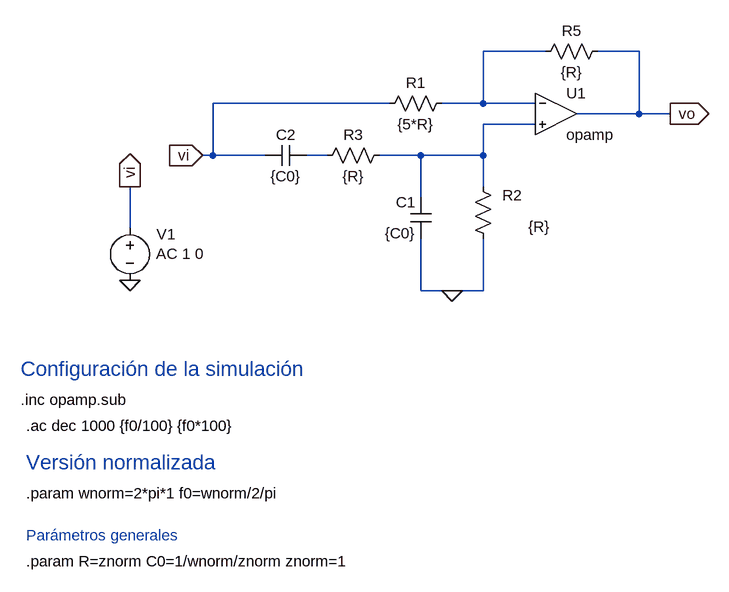
[diagram p0: schematic TS1.asc]
TS1.asc, the LTspice schematic file:
Version 4.1
SHEET 1 2616 1448
WIRE 256 -64 160 -64
WIRE 400 -64 336 -64
WIRE 16 16 -256 16
WIRE 160 16 160 -64
WIRE 160 16 96 16
WIRE 240 16 160 16
WIRE 400 32 400 -64
WIRE 400 32 304 32
WIRE 448 32 400 32
WIRE 240 48 160 48
WIRE -256 96 -256 16
WIRE -256 96 -272 96
WIRE -176 96 -256 96
WIRE -80 96 -112 96
WIRE 64 96 0 96
WIRE 160 96 160 48
WIRE 160 96 64 96
WIRE 160 144 160 96
WIRE 64 160 64 96
WIRE -384 208 -384 144
WIRE 64 304 64 224
WIRE 112 304 64 304
WIRE 160 304 160 224
WIRE 160 304 112 304
FLAG -272 96 vi
IOPIN -272 96 In
FLAG 448 32 vo
IOPIN 448 32 Out
FLAG -384 288 0
FLAG -384 144 vi
IOPIN -384 144 Out
FLAG 112 304 0
SYMBOL OpAmps\\opamp 272 -32 R0
SYMATTR InstName U1
SYMBOL res 176 240 R180
WINDOW 0 -44 83 Left 2
WINDOW 3 -87 34 Left 2
SYMATTR InstName R2
SYMATTR Value {R}
SYMBOL cap 80 224 R180
WINDOW 0 24 56 Left 2
WINDOW 3 24 8 Left 2
SYMATTR InstName C1
SYMATTR Value {C0}
SYMBOL res 240 -48 R270
WINDOW 0 32 56 VTop 2
WINDOW 3 0 56 VBottom 2
SYMATTR InstName R5
SYMATTR Value {R}
SYMBOL voltage -384 192 R0
WINDOW 123 40 55 Left 2
WINDOW 39 0 0 Left 0
WINDOW 0 41 25 Left 2
SYMATTR Value2 AC 1 0
SYMATTR InstName V1
SYMATTR Value ""
SYMBOL res 0 32 R270
WINDOW 0 32 56 VTop 2
WINDOW 3 0 56 VBottom 2
SYMATTR InstName R1
SYMATTR Value {5*R}
SYMBOL res -96 112 R270
WINDOW 0 32 56 VTop 2
WINDOW 3 0 56 VBottom 2
SYMATTR InstName R3
SYMATTR Value {R}
SYMBOL cap -176 112 R270
WINDOW 0 32 32 VTop 2
WINDOW 3 0 32 VBottom 2
SYMATTR InstName C2
SYMATTR Value {C0}
TEXT -552 472 Left 2 !.inc opamp.sub
TEXT -544 512 Left 2 !.ac dec 1000 {f0/100} {f0*100}
TEXT -544 568 Left 3 ;Versión normalizada
TEXT -544 616 Left 2 !.param wnorm=2*pi*1 f0=wnorm/2/pi
TEXT -544 720 Left 2 !.param R=znorm C0=1/wnorm/znorm znorm=1
TEXT -552 424 Left 3 ;Configuración de la simulación
TEXT -544 680 Left 2 ;Parámetros generales

The netlist it stands for:
* TS1.asc
X§U1 N001 N002 vo opamp Aol=100K GBW=10Meg  ; pins invin noninvin out
R2 0 N002 {R}
C1 0 N002 {C0}
R5 N001 vo {R}
V1 vi 0 AC 1 0
R1 vi N001 {5*R}
R3 N003 N002 {R}
C2 vi N003 {C0}
.inc opamp.sub
.ac dec 1000 {f0/100} {f0*100}
* Versión normalizada
.param wnorm=2*pi*1 f0=wnorm/2/pi
.param R=znorm C0=1/wnorm/znorm znorm=1
* Configuración de la simulación
* Parámetros generales
.backanno
.end